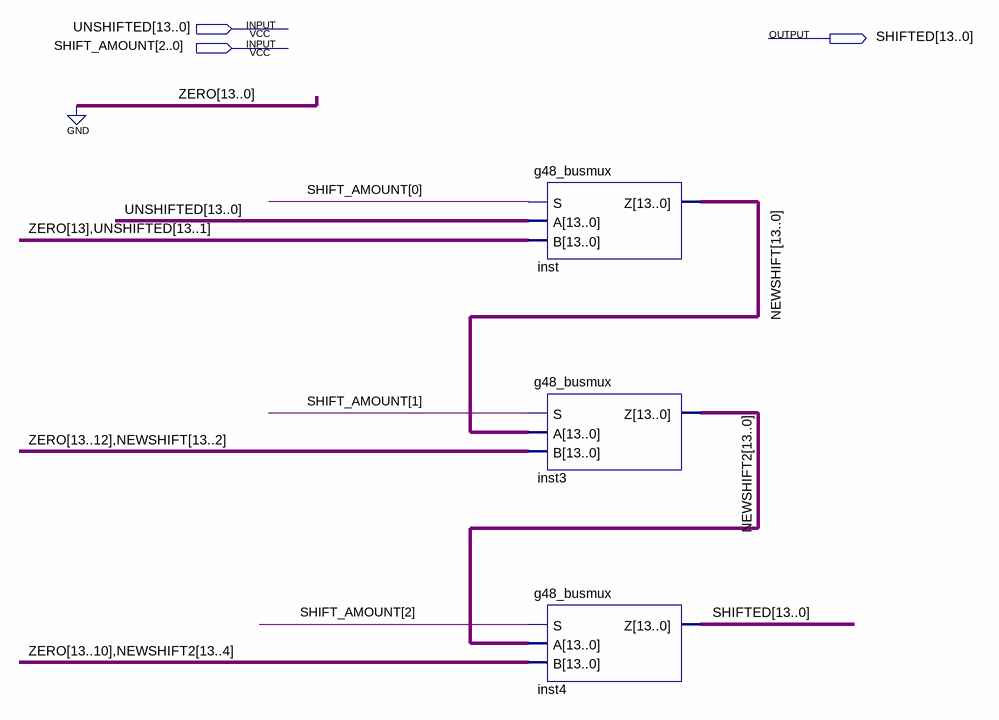
[diagram p0: schematic sheet]
// Quartus schematic g48_Barrel_Shifter.bdf as structural Verilog: 3 symbols, 3 pins
module g48_Barrel_Shifter (
  input  [13:0] UNSHIFTED,
  input  [2:0] SHIFT_AMOUNT,
  output [13:0] SHIFTED
);

  wire [13:0] NEWSHIFT, NEWSHIFT2;

  g48_busmux inst (.S(SHIFT_AMOUNT[0]), .A(UNSHIFTED), .B({1'b0, UNSHIFTED[13:1]}), .Z(NEWSHIFT));
  g48_busmux inst3 (.S(SHIFT_AMOUNT[1]), .A(NEWSHIFT), .B({2'b00, NEWSHIFT[13:2]}), .Z(NEWSHIFT2));
  g48_busmux inst4 (.S(SHIFT_AMOUNT[2]), .A(NEWSHIFT2), .B({4'b0000, NEWSHIFT2[13:4]}), .Z(SHIFTED));
endmodule
